# EAGLE design design (EAGLE 9.5.1)
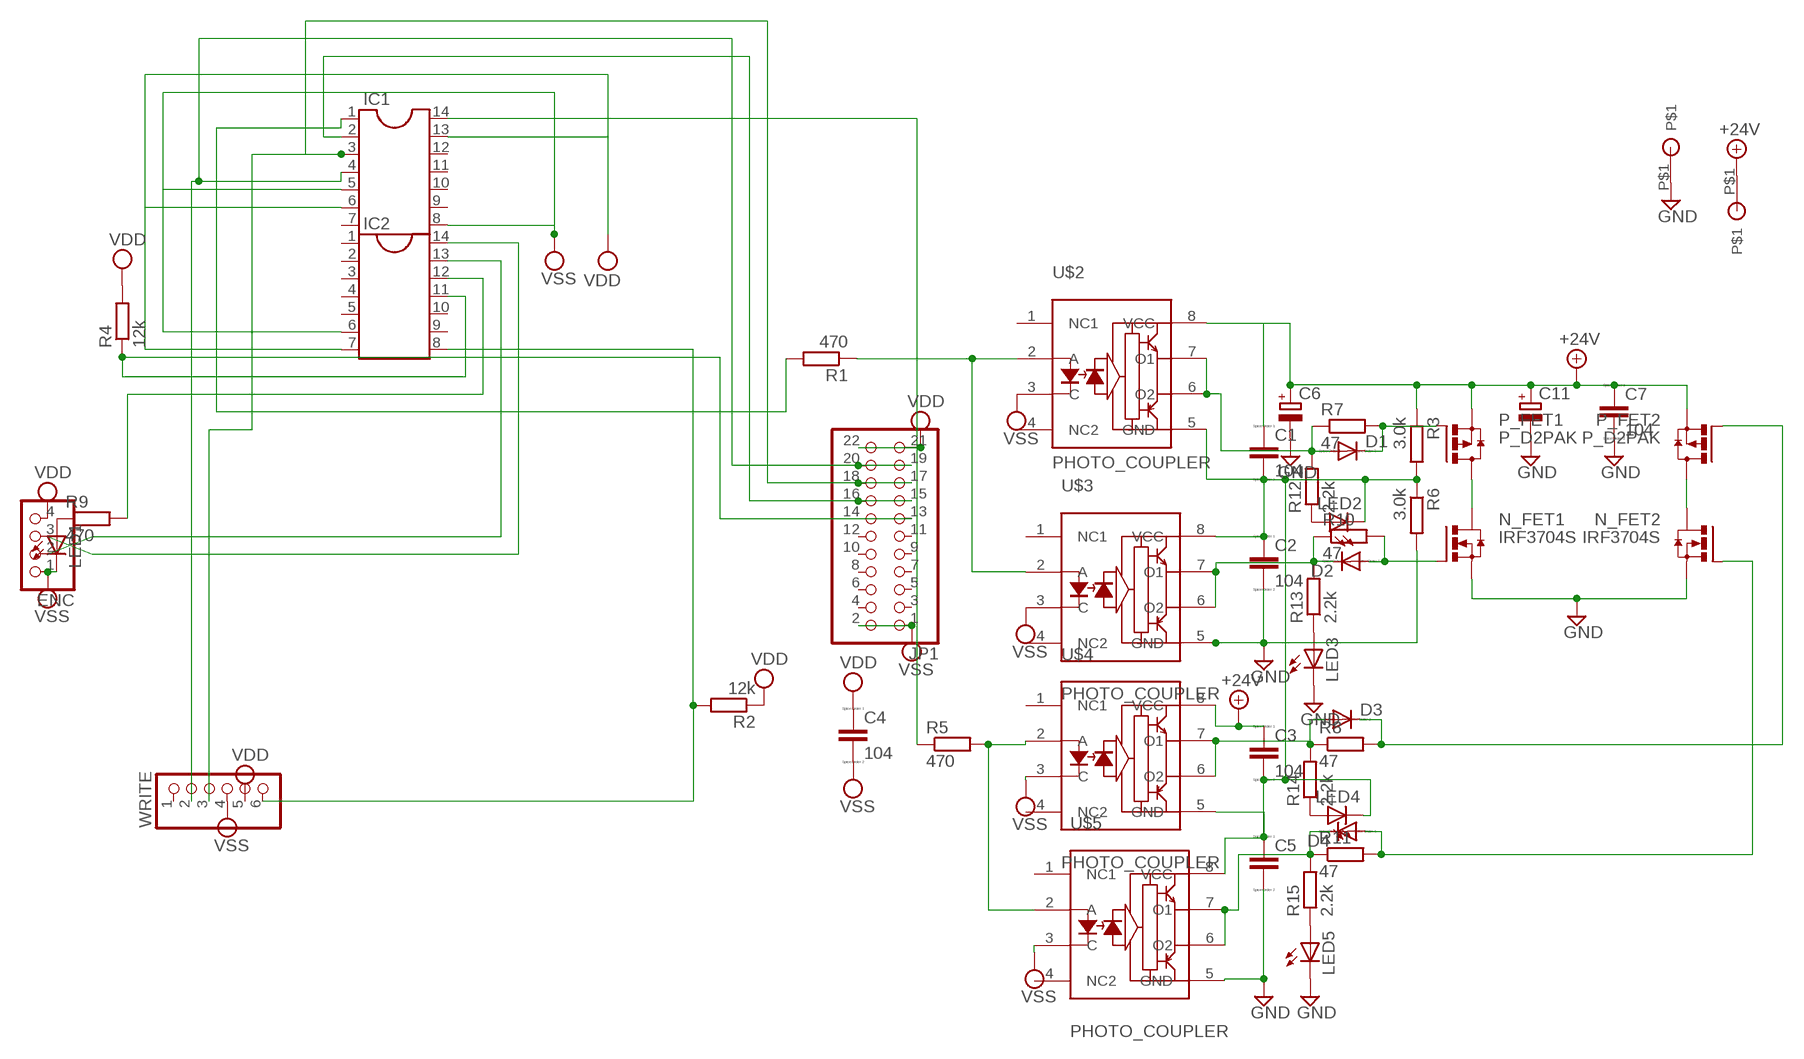
[diagram p0: schematic, sheet 1]

## Parts
C1  104  CC2012  [C2012]
C2  104  CC2012  [C2012]
C3  104  CC2012  [C2012]
C4  104  CC2012  [C2012]
C5  CC2012  [C2012]
C6  CPOL-EUTAP5-70  [TAP5-70]
C7  104  CC2012  [C2012]
C11  CPOL-EUE5-13  [E5-13]
D1  DIODE-SOD123  [SOD123]
D2  DIODE-SOD123  [SOD123]
D3  DIODE-SOD123  [SOD123]
D4  DIODE-SOD123  [SOD123]
ENC  PINHD-1X4/90  [1X04/90]
IC1  DIL14S  [SOCKET-14]
IC2  DIL14S  [SOCKET-14]
JP1  PINHD-2X11/90  [2X11/90]
LED1  LEDCHIP-LED0603  [CHIP-LED0603]
LED2  LEDCHIP-LED0603  [CHIP-LED0603]
LED3  LEDCHIP-LED0603  [CHIP-LED0603]
LED4  LEDCHIP-LED0603  [CHIP-LED0603]
LED5  LEDCHIP-LED0603  [CHIP-LED0603]
N_FET1  IRF3704S  [D2PACK]
N_FET2  IRF3704S  [D2PACK]
P_FET1  P_D2PAK  [D2PACK]
P_FET2  P_D2PAK  [D2PACK]
R1  470  R-EU_M0805  [M0805]
R2  12k  R-EU_M0805  [M0805]
R3  3.0k  R-EU_M0805  [M0805]
R4  12k  R-EU_M0805  [M0805]
R5  470  R-EU_M0805  [M0805]
R6  3.0k  R-EU_M0805  [M0805]
R7  47  R-EU_M0805  [M0805]
R8  47  R-EU_M0805  [M0805]
R9  470  R-EU_M0805  [M0805]
R10  47  R-EU_M0805  [M0805]
R11  47  R-EU_M0805  [M0805]
R12  2.2k  R-EU_M0805  [M0805]
R13  2.2k  R-EU_M0805  [M0805]
R14  2.2k  R-EU_M0805  [M0805]
R15  2.2k  R-EU_M0805  [M0805]
U$2  PHOTO_COUPLER  [DIL08]
U$3  PHOTO_COUPLER  [DIL08]
U$4  PHOTO_COUPLER  [DIL08]
U$5  PHOTO_COUPLER  [DIL08]
U$8  MARU  [MARU]
U$9  MARU  [MARU]
WRITE  PINHD-1X6/90  [1X06/90]

## Nets
+24V: C1.1 C3.1 C6.+ C7.1 C11.+ P_FET1.3(S) P_FET2.3(S) R3.1 U$2.8(VCC) U$4.8(VCC) U$8.P$1
GND: C2.2 C5.2 C6.- C7.2 C11.- LED3.C LED5.C N_FET1.3(S) N_FET2.3(S) R6.2 U$3.5(GND) U$5.5(GND) U$9.P$1
N$1: IC1.1 R1.2
N$2: R5.2 U$4.2(A) U$5.2(A)
N$3: R1.1 U$2.2(A) U$3.2(A)
N$4: LED1.A R9.1
N$5: IC1.14 R5.1
N$6: IC2.8 R2.2 WRITE.6
N$7: D2.C R10.1 R13.2 U$3.6(O2) U$3.7(O1)
N$8: D2.A N_FET1.1(G) R10.2
N$9: N_FET1.2(D) P_FET1.2(D)
N$10: C1.2 C2.1 C3.2 C5.1 LED2.C LED4.C R3.2 R6.1 U$2.5(GND) U$3.8(VCC) U$4.5(GND) U$5.8(VCC)
N$11: ENC.3 IC2.14
N$12: D4.C R11.1 R15.2 U$5.6(O2) U$5.7(O1)
N$13: D1.A R7.1 R12.2 U$2.6(O2) U$2.7(O1)
N$14: D3.A R8.1 R14.2 U$4.6(O2) U$4.7(O1)
N$15: IC2.12 R9.2
N$16: D1.C P_FET1.1(G) R7.2
N$17: ENC.2 IC2.13
N$18: IC1.2 JP1.15 JP1.16
N$19: IC2.11 JP1.13 JP1.14 R4.1
N$20: LED2.A R12.1
N$21: IC1.3 JP1.17 JP1.18 WRITE.3
N$22: IC1.4 JP1.19 JP1.20 WRITE.2
N$23: LED3.A R13.1
N$27: D4.A N_FET2.1(G) R11.2
N$28: D3.C P_FET2.1(G) R8.2
N$30: LED4.A R14.1
N$33: LED5.A R15.1
N$34: N_FET2.2(D) P_FET2.2(D)
VDD: C4.1 ENC.4 IC1.6 IC1.13 IC2.7 JP1.21 JP1.22 R2.1 R4.2 WRITE.5
VSS: C4.2 ENC.1 IC1.5 IC1.8 IC2.6 JP1.1 JP1.2 LED1.C U$2.3(C) U$3.3(C) U$4.3(C) U$5.3(C) WRITE.4
Unconnected: IC1.7 IC1.9 IC1.10 IC1.11 IC1.12 IC2.1 IC2.2 IC2.3 IC2.4 IC2.5 IC2.9 IC2.10 JP1.3 JP1.4 JP1.5 JP1.6 JP1.7 JP1.8 JP1.9 JP1.10 JP1.11 JP1.12 U$2.1(NC1) U$2.4(NC2) U$3.1(NC1) U$3.4(NC2) U$4.1(NC1) U$4.4(NC2) U$5.1(NC1) U$5.4(NC2) WRITE.1

## Library data of the parts
C1-C5 C7 = eagle-ltspice:C: CAPACITOR, European symbol; SPICEMODEL: NONE; SPICEPREFIX: C
C6 C11 = resistor:CPOL-EU: POLARIZED CAPACITOR, European symbol
D1-D4 = diode:DIODE-: DIODE
ENC = pinhead:PINHD-1X4: PIN HEADER
IC1 IC2 = ic-package:DIL14: Dual In Line / Socket
JP1 = pinhead:PINHD-2X11: PIN HEADER
LED1-LED5 = led:LED: LED OSRAM: - CHIPLED LG R971, LG N971, LY N971, LG Q971, LY Q971, LO R971, LY R971 LH N974, LH R974 LS Q976, LO Q976, LY Q976 LO Q996 - Hyper CHIPLED LW Q18S LB Q993, LB Q99A, LB R99A - SideLED LS A670, LO A670, LY A670, LG A670, LP A670 LB A673, LV A673, LT A673, LW A673 LH A674 LY A675 LS A676, LA A676, LO A676, LY A676, LW A676 LS A679, LY A679, LG A679 - Hyper Micro SIDELED® LS Y876, LA Y876, LO Y876, LY Y876 LT Y87S - SmartLED LW L88C, LW L88S LB L89C, LB L89S, LG L890 LS L89K, LO L89K, LY L89K LS L896, LA L896, LO L896, LY L896 - TOPLED LS T670, LO T670, LY T670, LG T670, LP T670 LSG T670, LSP T670, LSY T670, LOP T670, LYG T670 LG T671, LOG T671, LSG T671 LB T673, LV T673, LT T673, LW T673 LH T674 LS T676, LA T676, LO T676, LY T676, LB T676, LH T676, LSB T676, LW T676 LB T67C, LV T67C, LT T67C, LS T67K, LO T67K, LY T67K, LW E67C LS E67B, LA E67B, LO E67B, LY E67B, LB E67C, LV E67C, LT E67C LW T67C LS T679, LY T679, LG T679 LS T770, LO T770, LY T770, LG T770, LP T770 LB T773, LV T773, LT T773, LW T773 LH T774 LS E675, LA E675, LY E675, LS T675 LS T776, LA T776, LO T776, LY T776, LB T776 LHGB T686 LT T68C, LB T68C - Hyper Mini TOPLED® LB M676 - Mini TOPLED Santana® LG M470 LS M47K, LO M47K, LY M47K Source: http://www.osram.convergy.de LUXEON: - LUMILED® LXK2-PW12-R00, LXK2-PW12-S00, LXK2-PW14-U00, LXK2-PW14-V00 LXK2-PM12-R00, LXK2-PM12-S00, LXK2-PM14-U00 LXK2-PE12-Q00, LXK2-PE12-R00, LXK2-PE12-S00, LXK2-PE14-T00, LXK2-PE14-U00 LXK2-PB12-K00, LXK2-PB12-L00, LXK2-PB12-M00, LXK2-PB14-N00, LXK2-PB14-P00, LXK2-PB14-Q00 LXK2-PR12-L00, LXK2-PR12-M00, LXK2-PR14-Q00, LXK2-PR14-R00 LXK2-PD12-Q00, LXK2-PD12-R00, LXK2-PD12-S00 LXK2-PH12-R00, LXK2-PH12-S00 LXK2-PL12-P00, LXK2-PL12-Q00, LXK2-PL12-R00 Source: www.luxeon.com KINGBRIGHT: KA-3528ASYC Source: www.kingbright.com
N_FET1 N_FET2 = transistor-power:IRF3704: SMPS MOSFET HEXFET® Power MOSFET Source: http://www.irf.com/product-info/datasheets/data/irf3704.pdf
P_FET1 P_FET2 = transistor-power:P_D2PAK
R1-R15 = resistor:R-EU_: RESISTOR, European symbol
U$2-U$5 = photo_coupler:PHOTO_COUPLER
U$8 U$9 = abouters_hira:MARU
WRITE = pinhead:PINHD-1X6: PIN HEADER

## Board
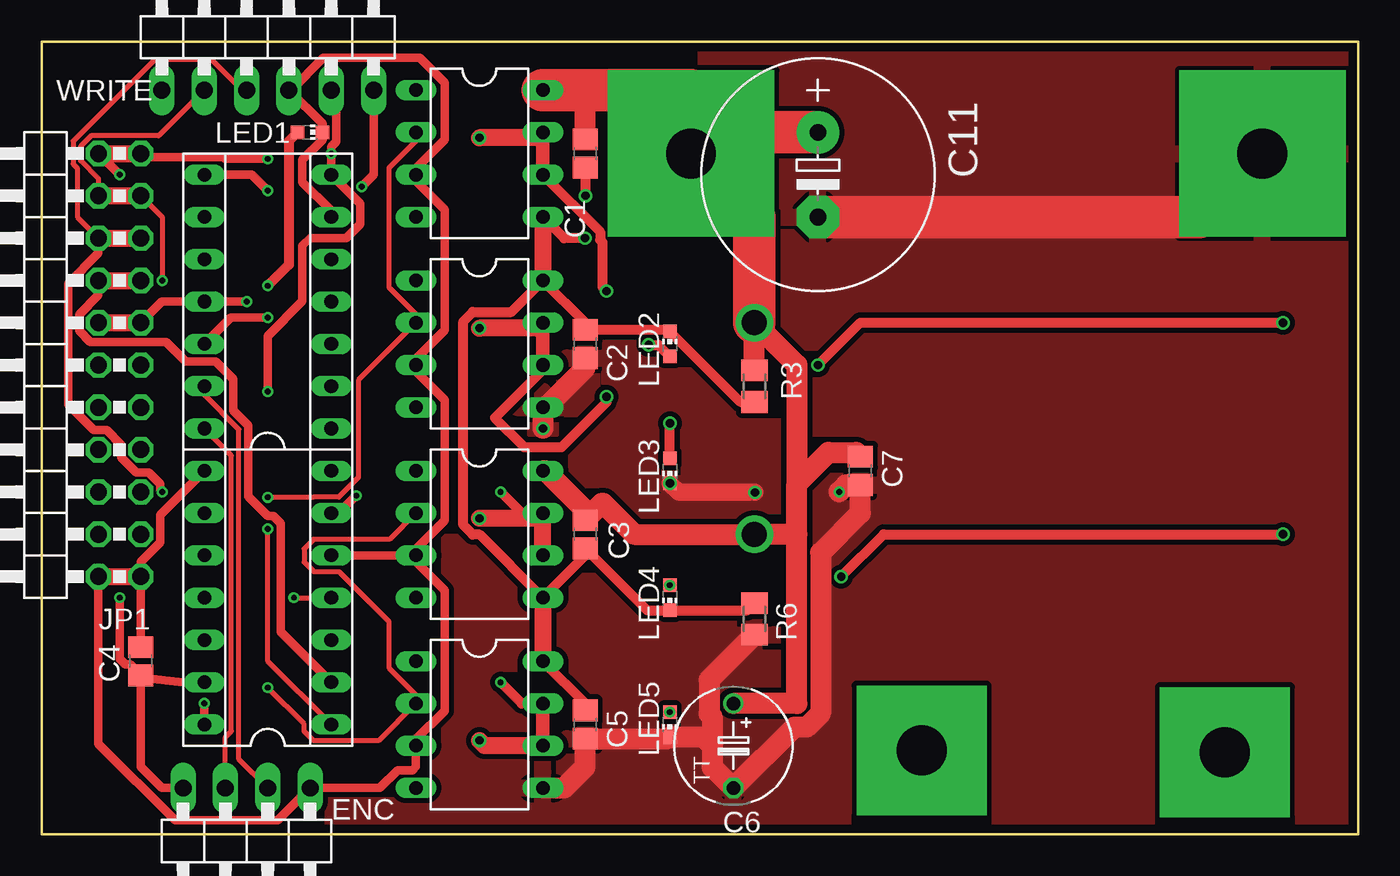
[diagram p1: board, top side]
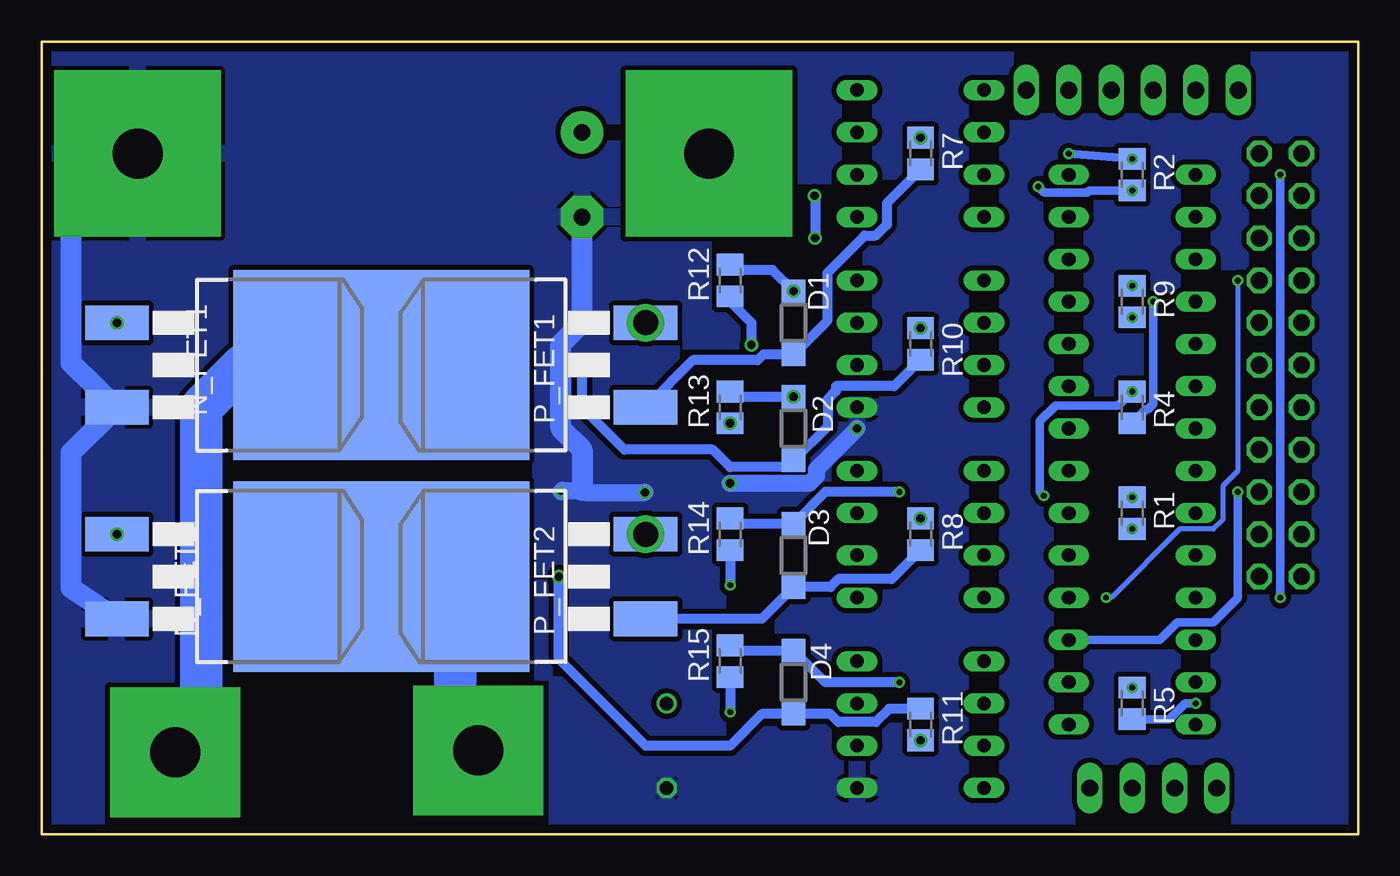
[diagram p2: board, bottom side, seen from below]

Size 79.02 x 47.6 mm. Coordinates in mm from the lower left corner, seen from the top.
Outline: 0,0 79.02,0 79.02,47.6 0,47.6 0,0
Copper layers (1*16): Top 0.035mm / dielectric 1.6mm / Bottom 0.035mm
Design rules "Elecrow_2-layer_PCB_eagle_rule": minimum track width 6mil, minimum drill 12mil, track to track 6mil, track to pad 6mil, pad to pad 6mil, via to via 8mil, smd to smd 0mil, copper to edge 20mil, drill to drill 10mil, minimum pad ring 6mil, minimum via ring 6mil, stop-mask expansion 0mil, vias tented up to drill 100mil, thermal gap 10mil

### Footprints (pad centres in the part's own frame; a part is rotated, then mirrored left to right if it is on the bottom)
C2012 = smd 1.3 x 1.5: 1 -0.85,0; 2 0.85,0
TAP5-70 = drill 0.813: + -2.54,0 | drill 0.813 octagon: - 2.54,0
E5-13 = drill 1.016 pad 2.54: + -2.54,0 | drill 1.016 pad 2.54 octagon: - 2.54,0
SOD123 = smd 1.4 x 1.4: A 1.9,0; C -1.9,0
1X04/90 = drill 1.016 long: 1 -3.81,-3.81; 2 -1.27,-3.81; 3 1.27,-3.81; 4 3.81,-3.81
SOCKET-14 = drill 0.813 long: 1 -7.62,-3.81; 2 -5.08,-3.81; 3 -2.54,-3.81; 4 0,-3.81; 5 2.54,-3.81; 6 5.08,-3.81; 7 7.62,-3.81; 8 7.62,3.81; 9 5.08,3.81; 10 2.54,3.81; 11 0,3.81; 12 -2.54,3.81; 13 -5.08,3.81; 14 -7.62,3.81
2X11/90 = drill 1.016 octagon: 1 -12.7,-6.35; 2 -12.7,-3.81; 3 -10.16,-6.35; 4 -10.16,-3.81; 5 -7.62,-6.35; 6 -7.62,-3.81; 7 -5.08,-6.35; 8 -5.08,-3.81; 9 -2.54,-6.35; 10 -2.54,-3.81; 11 0,-6.35; 12 0,-3.81; 13 2.54,-6.35; 14 2.54,-3.81; 15 5.08,-6.35; 16 5.08,-3.81; 17 7.62,-6.35; 18 7.62,-3.81; 19 10.16,-6.35; 20 10.16,-3.81; 21 12.7,-6.35; 22 12.7,-3.81
CHIP-LED0603 = smd 0.8 x 0.8: A 0,-0.75; C 0,0.75
D2PACK = smd 2.083 x 3.81: 1 -2.54,-8.89; 3 2.54,-8.89 | smd 11.43 x 8.89: 2 0,2.54
M0805 = smd 1.3 x 1.6: 1 -0.95,0; 2 0.95,0
DIL08 = drill 0.813 long: 1 -3.81,-3.81; 2 -1.27,-3.81; 3 1.27,-3.81; 4 3.81,-3.81; 5 3.81,3.81; 6 1.27,3.81; 7 -1.27,3.81; 8 -3.81,3.81
MARU = drill 3 pad 10 square: P$1 0,0
1X06/90 = drill 1.016 long: 1 -6.35,-3.81; 2 -3.81,-3.81; 3 -1.27,-3.81; 4 1.27,-3.81; 5 3.81,-3.81; 6 6.35,-3.81

### Placement (x,y rotation side)
C1  32.62,40.88 270 top
C2  32.62,29.45 270 top
C3  32.62,18.02 270 top
C4  5.95,10.4 90 top
C5  32.62,6.59 270 top
C6  41.51,5.32 270 top
C7  49.13,21.83 270 top
C11  46.59,39.61 270 top
D1  33.89,30.72 90 bottom
D2  33.89,24.37 270 bottom
D3  33.89,16.75 90 bottom
D4  33.89,9.13 270 bottom
ENC  12.3,-1.03 180 top
IC1  13.57,14.21 90 top
IC2  13.57,31.99 90 top
JP1  -0.4,28.18 90 top
LED1  16.11,42.15 270 top
LED2  37.7,29.45 0 top
LED3  37.7,21.83 180 top
LED4  37.7,14.21 180 top
LED5  37.7,6.59 180 top
N_FET1  65.61,28.18 270 bottom
N_FET2  65.61,15.48 270 bottom
P_FET1  51.67,28.18 90 bottom
P_FET2  51.67,15.48 90 bottom
R1  13.57,19.29 270 bottom
R2  13.57,39.61 270 bottom
R3  42.78,26.91 270 top
R4  13.57,25.64 90 bottom
R5  13.57,7.86 90 bottom
R6  42.78,12.94 270 top
R7  26.27,40.88 270 bottom
R8  26.27,18.02 270 bottom
R9  13.57,31.99 270 bottom
R10  26.27,29.45 270 bottom
R11  26.27,6.59 90 bottom
R12  37.7,33.26 90 bottom
R13  37.7,25.64 90 bottom
R14  37.7,18.02 90 bottom
R15  37.7,10.4 90 bottom
U$2  26.27,40.88 270 top
U$3  26.27,29.45 270 top
U$4  26.27,18.02 270 top
U$5  26.27,6.59 270 top
U$8  38.97,40.88 0 top
U$9  73.26,40.88 0 top
WRITE  13.57,48.5 0 top

### Tracks (layer width: path | path; a pad name or v marks a point on that pad's centre or on a via)
+24V  (via drill 1.5)
  Top 1.27: 45.32,18.02 P_FET2.3 35.55,18.02 33.7,19.88 33.63,19.88 C3.1 32.62,19.46 30.25,21.83 U$4.8 | 45.32,18.02 45.32,7.86 C6.+ | R3.1 P_FET1.3 45.32,28.18 45.32,21.04 | C1.1 32.62,44.69 | 45.32,18.02 45.32,21.04 | 45.32,21.04 47.21,22.93 48.88,22.93 C7.1
  Top 2.54: U$8.P$1 40.24,42.15 C11.+ | U$8.P$1 42.78,37.07 P_FET1.3 | U$2.8 32.62,44.69 38.97,44.69 U$8.P$1
  other vias: 42.78,30.72 42.78,18.02
GND  (via drill 0.35, 0.5)
  Top 1.016: v42.81,20.53 38.25,20.53 LED3.C
  Top 1.27: U$5.5 31.35,2.78 32.62,4.05 C5.2 37.6,5.74 LED5.C 39.72,5.84 40.24,5.32 | C2.2 32.62,28.01 30.25,25.64 U$3.5 v30.08,24.37 | R6.2 40.06,9.27 40.06,7.26 40.24,7.08 40.24,5.32 | 40.24,5.32 40.24,4.05 C6.- 45.17,6.44 45.91,6.44 46.74,7.27 46.74,16.9 49.13,19.29 C7.2 48.28,20.98 v47.86,20.56
  Top 2.54: C11.- 69.45,37.07 U$9.P$1
  Bottom 1.016: v30.08,24.37 32.53,21.92 32.53,21.5 32.95,21.08 LED3.C | v47.86,20.56 47.76,20.66 46.59,20.66 46.46,20.53 v42.81,20.53
  Bottom 1.27: 46.59,20.66 46.59,23.1 47.86,24.37 47.86,29.45 46.59,30.72 C11.- | N_FET2.3 77.27,14.81 77.27,22.91 N_FET1.3 77.27,28.32 77.27,38.14 74.53,40.88 U$9.P$1
  other vias: 37.7,21.08
  pour Top (isolate 0.305): 0.01,47.63 0.01,0.03 79.01,0.03 79.01,47.53 0.11,47.53
  pour Bottom (isolate 0.305): 0.01,47.63 0.01,0.03 79.01,0.03 79.01,47.63
N$1  (via drill 0.35)
  Top 0.305: IC1.1 13.57,10.4 R1.2
  other vias: 13.57,18.34
N$2  (via drill 0.35)
  Top 0.305: R5.2 15.75,6.63 15.75,6.19 16.32,5.62 20.23,5.62 U$5.2 22.46,8.38 20.83,10 20.83,12.78 17.83,15.79 16.32,15.79 15.75,16.35 15.75,17.15 16.32,17.71 20.89,17.71 U$4.2
  other vias: 13.57,8.81
N$3  (via drill 0.35)
  Top 0.305: R1.1 16.31,20.24 16.32,20.25 17.83,20.25 19.01,21.43 19.01,27.27 U$3.2 22.46,31.24 20.83,32.86 20.83,40.01 22.46,41.64 U$2.2
  other vias: 13.57,20.24
N$4  (via drill 0.35)
  Top 0.61: LED1.A 14.84,41.63 14.84,34.21 R9.1
  other vias: 13.57,32.94
N$5  (via drill 0.35)
  Top 0.508: IC1.14 v9.76,7.86
  Bottom 0.508: R5.1 11.35,6.91 10.4,7.86 v9.76,7.86
N$6  (via drill 0.35)
  Top 0.508: WRITE.6 19.92,39.61 v19.21,38.89 | IC2.8 12.62,39.61 R2.2
  Bottom 0.508: R2.2 16.16,38.66 16.28,38.54 18.85,38.54 v19.21,38.89
  other vias: 13.57,38.66
N$7  (via drill 0.5)
  Top 0.61: U$3.6 30.08,27.88 27.2,25 28.96,23.25 31.2,23.25 33.89,25.94 D2.C
  Top 0.813: U$3.7 U$3.6
  Top 1.016: U$3.7 29.76,30.4 R10.1
  Bottom 0.61: D2.C 37.38,26.27 R13.2
  other vias: 26.27,30.4 33.89,26.27
N$8  (via drill 0.5)
  Top 0.61: v46.59,28.18 49.13,30.72 49.51,30.72 | 49.51,30.72 N_FET1.1 | 49.51,30.72
  Bottom 0.61: R10.2 27.86,26.91 31.35,26.91 31.35,26.61 31.86,26.1 31.86,24.5 D2.A 34.31,22.04 37.7,22.04 38.75,23.1 44.05,23.1 45.25,24.29 46.59,25.64 v46.59,28.18
  other vias: 74.5,30.72
N$9  (via drill 3 pad 7.8)
  Bottom 2.54: P_FET1.2 64.36,28.18 64.37,28.17 N_FET1.2 66.91,28.18 69.45,25.64 69.45,6.29 v71.01,4.93
N$10  (via drill 0.5)
  Top 0.61: R3.2 41.94,25.96 LED2.C 37.6,30.3 C2.1 32.62,30.72 U$3.8 28.18,31.36 25.87,31.36 25.31,30.8 25.31,18.57 25.87,18 26.29,18 U$4.5 32.62,16.75 C3.2 36.33,13.46 LED4.C 42.35,13.46 R6.1 | U$5.8 32.62,7.86 C5.1 | C1.2 v32.63,38.35 | v32.6,35.8 31.35,35.8 U$2.5
  Top 1.016: U$2.5 U$3.8 | U$4.5 U$5.8
  Bottom 0.61: v32.63,38.35 32.6,38.32 v32.6,35.8
N$11
  Top 0.305: ENC.3 11.03,5.84 11.39,6.19 11.39,22.74 IC2.14
N$12  (via drill 0.35, 0.5)
  Top 0.61: U$5.7 28.81,7.86 v27.54,9.13
  Top 0.813: U$5.7 U$5.6
  Top 1.016: U$5.6 26.59,5.32 R11.1
  Bottom 0.61: R15.2 37.38,11.03 D4.C 31.99,9.13 v27.54,9.13
  other vias: 26.27,5.64
N$13  (via drill 0.5)
  Top 0.61: U$2.6 33.51,36.18 33.51,35.69 33.65,35.56 33.65,32.86 D1.A
  Top 0.813: U$2.7 U$2.6
  Top 1.016: U$2.7 29.76,41.83 R7.1
  Bottom 0.61: R12.2 37.38,33.89 35.16,33.89 D1.A
  other vias: 26.27,41.83 33.89,32.62
N$14  (via drill 0.35, 0.5)
  Top 0.61: U$4.7 28.81,19.29 v27.54,20.56
  Top 1.016: U$4.6 U$4.7 29.76,18.97 R8.1
  Bottom 0.61: v27.54,20.56 31.98,20.56 D3.A 37.38,18.65 R14.2
  other vias: 26.27,18.97
N$15  (via drill 0.35)
  Top 0.508: IC2.12 11.35,31.04 R9.2
  other vias: 13.57,31.04
N$16
  Bottom 0.61: R7.2 28.3,37.9 28.3,36.61 28.96,35.95 29.63,35.95 31.86,33.72 31.86,30.85 D1.C 35.71,28.82 36.05,28.48 39.94,28.48 P_FET1.1
N$17
  Top 0.305: IC2.13 9.76,26.39 11.84,24.31 11.84,4.51 ENC.2
N$18
  Top 0.508: IC1.2 14.36,12.16 14.36,18.67 13.89,19.13 13.58,19.13 12.4,20.3 12.4,24.54 11.49,25.46 11.49,27.35 10.46,28.38 8.66,28.38 7.49,29.55 2.93,29.55 2.24,30.24 2.24,31.2 3.41,32.37 JP1.16
  Top 1.016: JP1.16 JP1.15
N$19  (via drill 0.35)
  Top 0.508: JP1.13 7.22,31.99 IC2.11 v12.3,31.99
  Top 1.016: JP1.14 JP1.13
  Bottom 0.508: R4.1 12.73,25.53 12.6,25.53 12.3,25.83 v12.3,31.99
N$20  (via drill 0.5)
  Top 0.61: v36.43,29.39 37.01,29.39 LED2.A
  Bottom 0.61: R12.1 37.7,31.99 36.43,30.72 v36.43,29.39
N$21  (via drill 0.35)
  Top 0.305: WRITE.3 12.03,44.69 10.2,46.52 6.78,46.52 1.89,41.63 1.89,40.25 2.14,40 2.14,37.07 JP1.18
  Top 0.508: v7.24,20.56 7.12,20.68 7.12,21.04 6.43,21.73 5.67,21.73 4.78,22.62 4.78,23.38 3.89,24.27 3.13,24.27 1.58,25.82 1.58,33.08 3.41,34.91 JP1.18
  Top 1.016: JP1.18 JP1.17
  Bottom 0.508: v7.24,20.56 7.24,14.19 8.69,12.74 10.86,12.74 11.93,11.67 IC1.3
N$22  (via drill 0.35)
  Top 0.305: WRITE.2 7.02,41.95 2.97,41.95 2.34,41.32 2.34,40.44 3.41,39.37 JP1.20 | JP1.19 7.24,37.05 v7.24,33.26 | v15.14,14.21 IC1.4
  Top 1.016: JP1.20 JP1.19
  Bottom 0.305: v7.24,33.26 7.24,21.81 8.13,20.92 8.13,18.89 8.7,18.32 10.73,18.32 14.84,14.21 v15.14,14.21
N$23  (via drill 0.5)
  Top 0.61: LED3.A R13.1
  other vias: 37.7,24.69
N$27  (via drill 0.5)
  Top 0.61: v47.98,15.48 50.52,18.02 N_FET2.1
  Bottom 0.61: R11.2 28.16,7.54 28.96,6.74 31.2,6.74 31.69,7.23 D4.A 35.79,7.23 37.7,5.32 42.78,5.32 47.98,10.52 v47.98,15.48
  other vias: 74.5,18.02
N$28
  Bottom 0.61: R8.2 28.01,15.33 31.2,15.33 31.68,14.85 D3.C 35.8,12.94 P_FET2.1
N$30  (via drill 0.35)
  Bottom 0.61: R14.1 LED4.A
  other vias: 37.7,14.96
N$33  (via drill 0.35)
  Bottom 0.61: R15.1 LED5.A
  other vias: 37.7,7.34
N$34  (via drill 3 pad 7.8)
  Bottom 2.54: N_FET2.2 P_FET2.2 54.21,6.39 v52.81,5.03
VDD  (via drill 0.35)
  Top 0.508: JP1.21 6.15,40.68 10.86,40.68 10.98,40.56 R2.1 | WRITE.5 17.67,44.4 17.67,41.58 17.38,41.3 v17.38,40.88 IC2.7 19.11,37.88 19.11,36.63 18.28,35.8 16.11,35.8 15.65,35.34 15.65,32.01 13.57,29.93 R4.2 | C4.1 6.11,9.39 8.49,9.13 IC1.13 | C4.1 5.95,4.05 7.22,2.78 ENC.4 | v18.88,20.33 17.83,19.29 IC1.6 | C4.1 5.31,10.19 5.03,10.19 4.68,10.55 v4.68,14.21 | v4.68,39.61 JP1.22
  Top 1.016: JP1.22 JP1.21
  Bottom 0.508: R2.1 v17.38,40.88 | R4.2 14.41,25.75 18.17,25.75 19.11,24.81 19.11,20.57 v18.88,20.33 | v4.68,14.21 v4.68,39.61
  other vias: 13.57,40.56 13.57,26.59
VSS
  Top 0.508: C4.2 JP1.1 5.95,16.37 7.12,17.54 7.12,19.19 IC1.8 | IC1.5 U$4.3 | U$4.3 22.46,17.12 24.19,18.85 24.19,26.08 22.46,27.81 U$3.3 22.46,28.55 24.19,30.28 24.19,37.51 22.46,39.24 U$2.3 22.46,39.98 24.19,41.71 24.19,45.13 22.7,46.62 16.9,46.62 14.97,44.69 WRITE.4 16.86,42.67 LED1.C 16.86,41.71 15.65,40.5 15.65,39.17 17.38,37.44 IC2.6 | U$4.3 22.46,16.38 24.19,14.65 24.19,7.42 22.46,5.69 U$5.3 22.46,4.05 22.26,3.85 21.36,3.85 20.29,2.78 ENC.1 14.18,0.85 8.01,0.85 3.41,5.45 JP1.2
  Top 1.016: JP1.2 JP1.1